# Altium schematic sheet Connector.SchDoc
size A3
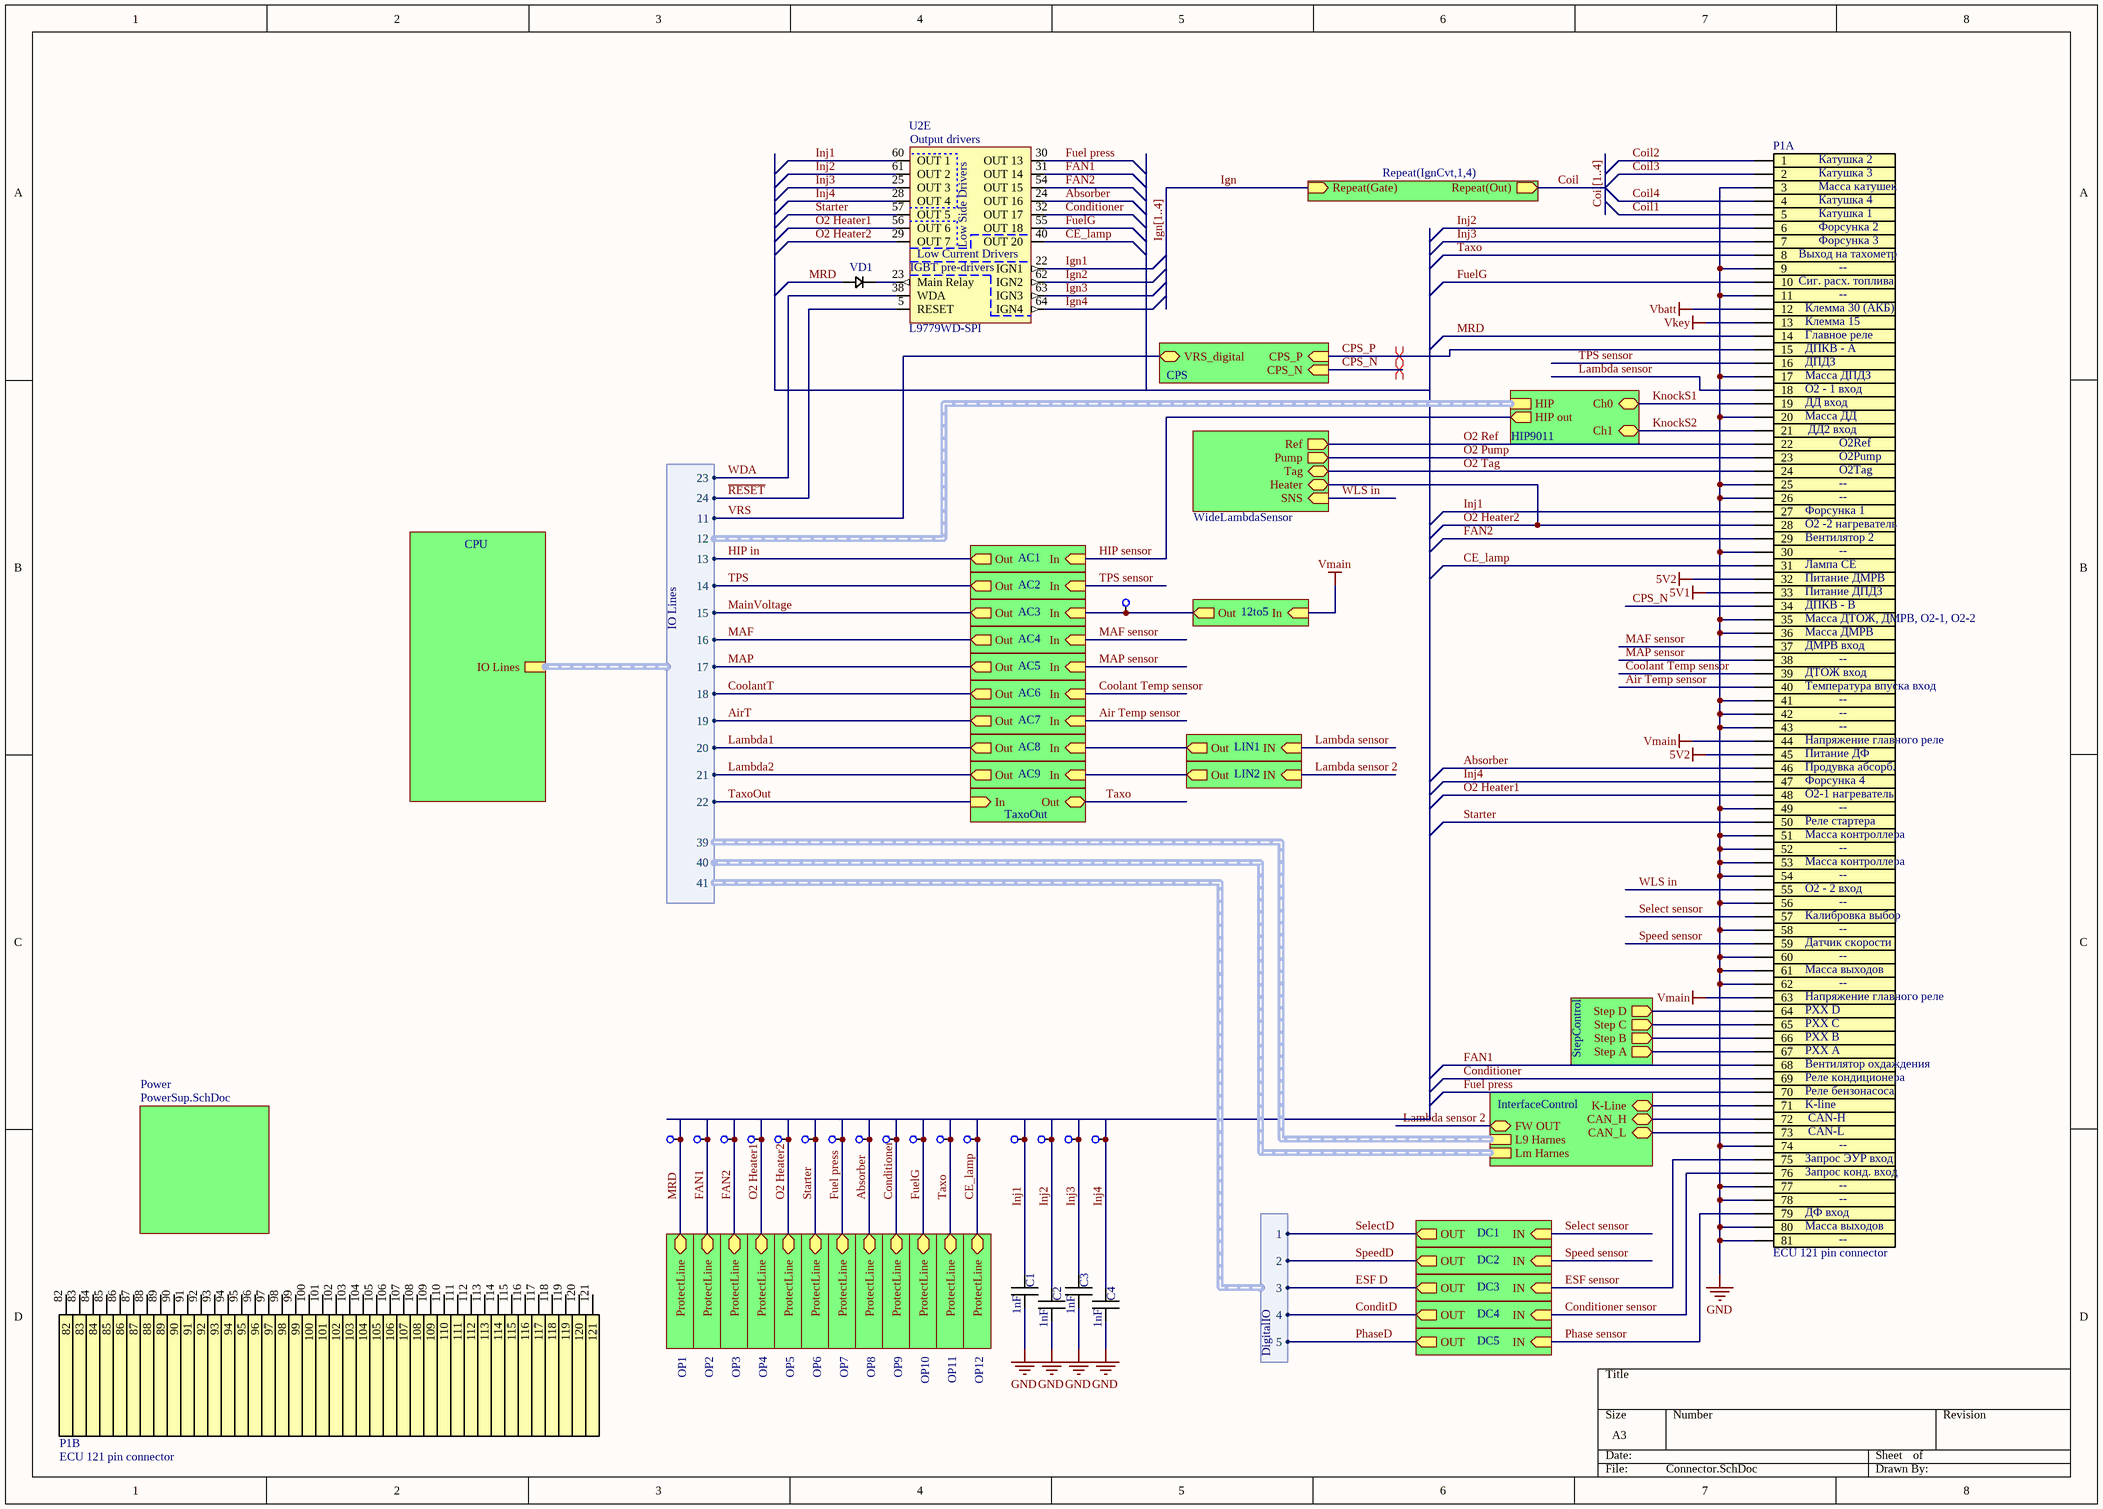
[diagram p0: Connector.SchDoc]

## Parts
C1  1nF  [SMD 0603]
C2  1nF  [SMD 0603]
C3  1nF  [SMD 0603]
C4  1nF  [SMD 0603]
P1  ECU 121 pin connector  [1241434-1]  (parts A,B of 2)  (no BOM)
TP1  TestPoint  [TESTPOINT]  (value not drawn)
TP2  TestPoint  [TESTPOINT]  (value not drawn)
TP3  TestPoint  [TESTPOINT]  (value not drawn)
TP4  TestPoint  [TESTPOINT]  (value not drawn)
TP5  TestPoint  [TESTPOINT]  (value not drawn)
TP6  TestPoint  [TESTPOINT]  (value not drawn)
TP7  TestPoint  [TESTPOINT]  (value not drawn)
TP8  TestPoint  [TESTPOINT]  (value not drawn)
TP9  TestPoint  [TESTPOINT]  (value not drawn)
TP10  TestPoint  [TESTPOINT]  (value not drawn)
TP11  TestPoint  [TESTPOINT]  (value not drawn)
TP12  TestPoint  [TESTPOINT]  (value not drawn)
TP13  TestPoint  [TESTPOINT]  (value not drawn)
TP14  TestPoint  [TESTPOINT]  (value not drawn)
TP15  TestPoint  [TESTPOINT]  (value not drawn)
TP16  TestPoint  [TESTPOINT]  (value not drawn)
TP17  TestPoint  [TESTPOINT]  (value not drawn)
U2  L9779WD-SPI  [HiQUAD-64]  (part E of 6)
VD1  Diode  [DO-214AC]  (value not drawn)

## Sub-sheets
12to5 = Convert12to5.SchDoc: In (in), Out (out)
AC1 = AnalogIn.SchDoc: Out (out), In (in)
AC2 = AnalogIn.SchDoc: Out (out), In (in)
AC3 = AnalogIn.SchDoc: Out (out), In (in)
AC4 = AnalogIn.SchDoc: Out (out), In (in)
AC5 = AnalogIn.SchDoc: Out (out), In (in)
AC6 = AnalogIn.SchDoc: Out (out), In (in)
AC7 = AnalogIn.SchDoc: Out (out), In (in)
AC8 = AnalogIn.SchDoc: Out (out), In (in)
AC9 = AnalogIn.SchDoc: Out (out), In (in)
CPS = VRS.SchDoc: CPS_P (in), VRS_digital (bidir), CPS_N (in)
CPU = CPU_A.SchDoc: IO Lines (harness IO Lines)
DC1 = DigitalConverter.SchDoc: IN (in), OUT (out)
DC2 = DigitalConverter.SchDoc: IN (in), OUT (out)
DC3 = DigitalConverter.SchDoc: IN (in), OUT (out)
DC4 = DigitalConverter.SchDoc: IN (in), OUT (out)
DC5 = DigitalConverter.SchDoc: IN (in), OUT (out)
HIP9011 = HIP9011.SchDoc: HIP (harness HIP), Ch0 (bidir), Ch1 (bidir), HIP out (out)
InterfaceControl = Interface.SchDoc: CAN_L (bidir), CAN_H (bidir), K-Line (bidir), FW OUT (bidir), L9 Harnes (harness L9 Harnes), Lm Harnes (harness Lm Harnes)
LIN1 = LambdaIn.SchDoc: Out (out), IN (in)
LIN2 = LambdaIn.SchDoc: Out (out), IN (in)
OP1 = OutProtect.SchDoc: ProtectLine (bidir)
OP2 = OutProtect.SchDoc: ProtectLine (bidir)
OP3 = OutProtect.SchDoc: ProtectLine (bidir)
OP4 = OutProtect.SchDoc: ProtectLine (bidir)
OP5 = OutProtect.SchDoc: ProtectLine (bidir)
OP6 = OutProtect.SchDoc: ProtectLine (bidir)
OP7 = OutProtect.SchDoc: ProtectLine (bidir)
OP8 = OutProtect.SchDoc: ProtectLine (bidir)
OP9 = OutProtect.SchDoc: ProtectLine (bidir)
OP10 = OutProtect.SchDoc: ProtectLine (bidir)
OP11 = OutProtect.SchDoc: ProtectLine (bidir)
OP12 = OutProtect.SchDoc: ProtectLine (bidir)
Power = PowerSup.SchDoc: no entries
Repeat(IgnCvt,1,4) = IgnMOSFET.SchDoc: Repeat(Gate) (in), Repeat(Out) (out)
StepControl = StepDrive.SchDoc: Step C (out), Step D (out), Step B (out), Step A (out)
TaxoOut = TaxoOut.SchDoc: Out (bidir), In (in)
WideLambdaSensor = LambdaWide.SchDoc: SNS (in), Heater (bidir), Ref (out), Pump (out), Tag (bidir)

## Harnesses
DigitalIO: 1, 2, 3, 4, 5
IO Lines: 11, 12, 13, 14, 15, 16, 17, 18, 19, 20, 21, 22, 23, 24, 39, 40, 41

## Nets
5V1: P1.33
5V2: P1.32 P1.45
GND: C1.1 C2.1 C3.1 C4.1 P1.3 P1.9 P1.11 P1.17 P1.20 P1.25 P1.26 P1.30 P1.35 P1.36 P1.41 P1.42 P1.43 P1.49 P1.51 P1.52 P1.53 P1.54 P1.56 P1.58 P1.60 P1.61 P1.62 P1.74 P1.77 P1.78 P1.80 P1.81
Vbatt: P1.12
Vkey: P1.13
Vmain: P1.44 P1.63 ; sheet 12to5/In
~{RESET}: U2.5(RESET) ; sheet CPU/IO Lines.24
Absorber: P1.46 TP8.0 U2.24(OUT_16) ; sheet OP8/ProtectLine
Air Temp sensor: P1.40 ; sheet AC7/In
AirT: sheet AC7/Out, sheet CPU/IO Lines.19
CE_lamp: P1.31 TP12.0 U2.40(OUT_20) ; sheet OP12/ProtectLine
Coil: sheet Repeat(IgnCvt,1,4)/Repeat(Out)
Coil1: P1.5
Coil2: P1.1
Coil3: P1.2
Coil4: P1.4
ConditD: sheet DC4/OUT, harness DigitalIO.4
Conditioner: P1.69 TP9.0 U2.32(OUT_17) ; sheet OP9/ProtectLine
Conditioner sensor: P1.76 ; sheet DC4/IN
Coolant Temp sensor: P1.39 ; sheet AC6/In
CoolantT: sheet AC6/Out, sheet CPU/IO Lines.18
CPS_N: P1.34 ; sheet CPS/CPS_N
CPS_P: P1.15 ; sheet CPS/CPS_P
ESF D: sheet DC3/OUT, harness DigitalIO.3
ESF sensor: P1.75 ; sheet DC3/IN
FAN1: P1.68 TP2.0 U2.31(OUT_14) ; sheet OP2/ProtectLine
FAN2: P1.29 TP3.0 U2.54(OUT_15) ; sheet OP3/ProtectLine
Fuel press: P1.70 TP7.0 U2.30(OUT_13) ; sheet OP7/ProtectLine
FuelG: P1.10 TP10.0 U2.55(OUT_18) ; sheet OP10/ProtectLine
HIP in: sheet AC1/Out, sheet CPU/IO Lines.13
HIP sensor: sheet HIP9011/HIP out, sheet AC1/In
Ign: sheet Repeat(IgnCvt,1,4)/Repeat(Gate)
Ign1: U2.22(IGN1)
Ign2: U2.62(IGN2)
Ign3: U2.63(IGN3)
Ign4: U2.64(IGN4)
Inj1: C1.2 P1.27 TP13.0 U2.60(OUT_1)
Inj2: C2.2 P1.6 TP14.0 U2.61(OUT_2)
Inj3: C3.2 P1.7 TP15.0 U2.25(OUT_3)
Inj4: C4.2 P1.47 TP16.0 U2.28(OUT_4)
KnockS1: P1.19 ; sheet HIP9011/Ch0
KnockS2: P1.21 ; sheet HIP9011/Ch1
Lambda1: sheet AC8/Out, sheet CPU/IO Lines.20
Lambda2: sheet AC9/Out, sheet CPU/IO Lines.21
Lambda sensor: P1.18 ; sheet LIN1/IN
Lambda sensor 2: sheet InterfaceControl/FW OUT, sheet LIN2/IN
MAF: sheet AC4/Out, sheet CPU/IO Lines.16
MAF sensor: P1.37 ; sheet AC4/In
MainVoltage: sheet AC3/Out, sheet CPU/IO Lines.15
MAP: sheet AC5/Out, sheet CPU/IO Lines.17
MAP sensor: P1.38 ; sheet AC5/In
MRD: P1.14 TP1.0 VD1.0 ; sheet OP1/ProtectLine
O2 Heater1: P1.48 TP4.0 U2.56(OUT_6) ; sheet OP4/ProtectLine
O2 Heater2: P1.28 TP5.0 U2.29(OUT_7) ; sheet OP5/ProtectLine, sheet WideLambdaSensor/Heater
O2 Pump: P1.23 ; sheet WideLambdaSensor/Pump
O2 Ref: P1.22 ; sheet WideLambdaSensor/Ref
O2 Tag: P1.24 ; sheet WideLambdaSensor/Tag
Phase sensor: P1.79 ; sheet DC5/IN
PhaseD: sheet DC5/OUT, harness DigitalIO.5
Select sensor: P1.57 ; sheet DC1/IN
SelectD: sheet DC1/OUT, harness DigitalIO.1
Speed sensor: P1.59 ; sheet DC2/IN
SpeedD: sheet DC2/OUT, harness DigitalIO.2
Starter: P1.50 TP6.0 U2.57(OUT_5) ; sheet OP6/ProtectLine
Taxo: P1.8 TP11.0 ; sheet OP11/ProtectLine, sheet TaxoOut/Out
TaxoOut: sheet TaxoOut/In, sheet CPU/IO Lines.22
TPS: sheet AC2/Out, sheet CPU/IO Lines.14
TPS sensor: P1.16 ; sheet AC2/In
VRS: sheet CPS/VRS_digital, sheet CPU/IO Lines.11
WDA: U2.38(WDA) ; sheet CPU/IO Lines.23
WLS in: P1.55 ; sheet WideLambdaSensor/SNS
NetP1_64: P1.64 ; sheet StepControl/Step D
NetP1_65: P1.65 ; sheet StepControl/Step C
NetP1_66: P1.66 ; sheet StepControl/Step B
NetP1_67: P1.67 ; sheet StepControl/Step A
NetP1_71: P1.71 ; sheet InterfaceControl/K-Line
NetP1_72: P1.72 ; sheet InterfaceControl/CAN_H
NetP1_73: P1.73 ; sheet InterfaceControl/CAN_L
NetTP17_0: TP17.0 ; sheet AC3/In, sheet 12to5/Out
NetU2_23: U2.23(Main_Relay) VD1.1
(unnamed): sheet AC8/In, sheet LIN1/Out
(unnamed): sheet AC9/In, sheet LIN2/Out

Not connected (* = marked no-connect by the designer): P1 82 83 84 85 86 87 88 89 90 91 92 93 94 95 96 97 98 99 100 101 102 103 104 105 106 107 108 109 110 111 112 113 114 115 116 117 118 119 120 121

## Buses and harness runs
bus Coil[1..4]
bus Ign[1..4]

## Layout directives
differential pair: CPS_N, CPS_P

## Notes on the sheet
- (near P1) Катушка 2
- (near P1) Катушка 3
- (near P1) Катушка 1
- (near P1) Катушка 4
- (near P1) Масса катушек
- (near P1) Форсунка 2
- (near P1) Форсунка 3
- (near P1) Выход на тахометр
- (near P1) Сиг. расх. топлива
- (near P1) Клемма 30 (АКБ)
- --
- (near P1) Клемма 15
- (near P1) Главное реле
- (near P1) ДПКВ - А
- (near P1) Масса ДПДЗ
- (near P1) ДПДЗ
- (near P1) О2 - 1 вход
- (near P1) ДД вход
- (near P1) Масса ДД
- (near P1) ДД2 вход
- O2Ref
- (near P1) Форсунка 1
- O2Pump
- O2Tag
- (near P1) О2 -2 нагреватель
- (near P1) Вентилятор 2
- (near P1) Лампа CE
- (near P1) Питание ДМРВ
- (near P1) Питание ДПДЗ
- (near P1) ДПКВ - В
- (near P1) Масса ДТОЖ, ДМРВ, О2-1, О2-2
- (near P1) Масса ДМРВ
- (near P1) ДМРВ вход
- (near P1) ДТОЖ вход
- (near P1) Температура впуска вход
- (near P1) Форсунка 4
- (near P1) Продувка абсорб.
- (near P1) Питание ДФ
- (near P1) Напряжение главного реле
- (near P1) О2-1 нагреватель
- (near P1) Реле стартера
- (near P1) Масса контроллера
- (near P1) О2 - 2 вход
- (near P1) Калибровка выбор
- (near P1) Датчик скорости
- (near P1) Масса выходов
- (near P1) РХХ А
- (near P1) РХХ B
- (near P1) РХХ C
- (near P1) РХХ D
- (near P1) Вентилятор охдаждения
- (near P1) Реле кондиционера
- (near P1) Реле бензонасоса
- (near P1) K-line
- (near P1) CAN-H
- (near P1) Запрос ЭУР вход
- (near P1) Запрос конд. вход
- (near P1) CAN-L
- (near P1) ДФ вход
- (in symbol L9779WD-SPI, part E) Output drivers; Low Side Drivers; Low Current Drivers; IGBT pre-drivers

## Library data of the parts
C1-C4 = Capasitor: CC0603KRX7R9BB102; Value: 1nF
P1 = 1241434-1
U2 = L9779WD-SPI: Multifunction IC for engine management system
VD1 = Diode: STTH2R02A